# Altium project Smart_Controler.PrjPcb
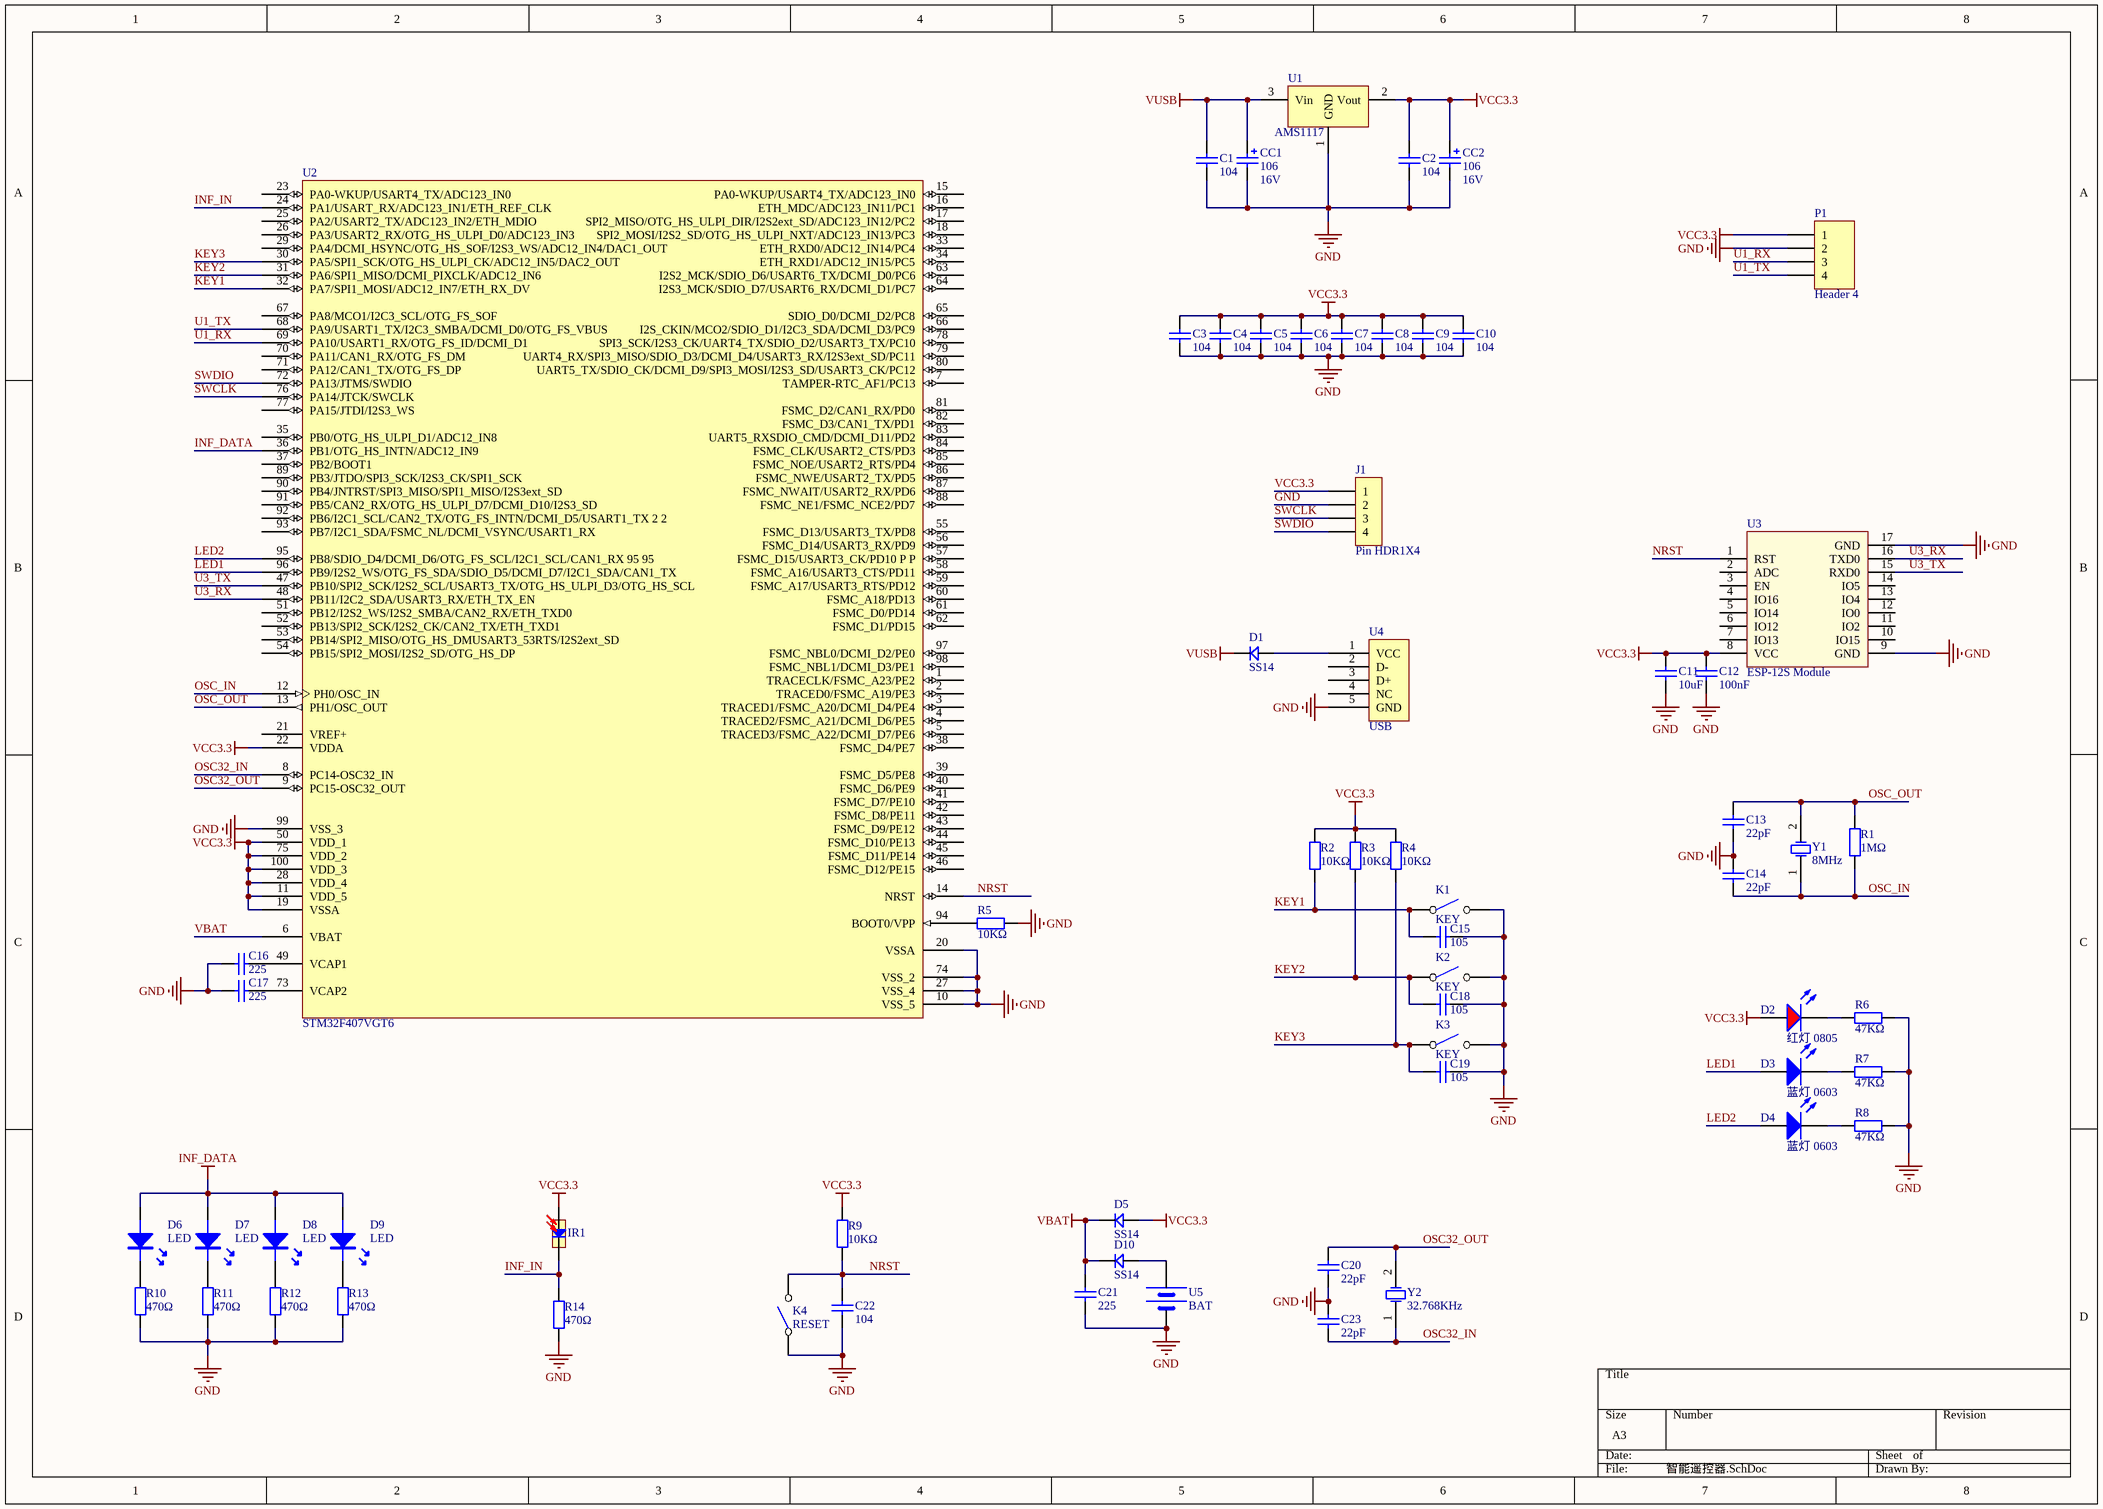
[diagram p0: 智能遥控器.SchDoc]
1 sheet, 63 parts. Net scope: global (net labels, ports and power ports of the same name join across sheets).
Board file: 智能遥控器.PcbDoc

## Sheet 智能遥控器.SchDoc
size A3

### Parts
C1  104  [LC-0805_C]
C2  104  [LC-0805_C]
C3  104  [LC-0805_C]
C4  104  [LC-0805_C]
C5  104  [LC-0805_C]
C6  104  [LC-0805_C]
C7  104  [LC-0805_C]
C8  104  [LC-0805_C]
C9  104  [LC-0805_C]
C10  104  [LC-0805_C]
C11  10uF  [LC-0805_C]
C12  100nF  [LC-0805_C]
C13  22pF  [LC-0805_C]
C14  22pF  [LC-0805_C]
C15  105  [LC-0805_C]
C16  225  [LC-0805_C]
C17  225  [LC-0805_C]
C18  105  [LC-0805_C]
C19  105  [LC-0805_C]
C20  22pF  [LC-0805_C]
C21  225  [LC-0805_C]
C22  104  [LC-0805_C]
C23  22pF  [LC-0805_C]
CC1  Capacitance: 106  Voltage: 16V  [TAN-C-6032]  (hidden comment: Cap Tan C)
CC2  Capacitance: 106  Voltage: 16V  [TAN-C-6032]  (hidden comment: Cap Tan C)
D1  SS14  [LC-SOD-123]
D2  红灯 0805  [LC-0805_LED_S1]
D3  蓝灯 0603  [LC-0805_LED_S1]
D4  蓝灯 0603  [LC-0805_LED_S1]
D5  SS14  [LC-SOD-123]
D6  LED  [LED5-RED]
D7  LED  [LED5-RED]
D8  LED  [LED5-RED]
D9  LED  [LED5-RED]
D10  SS14  [LC-SOD-123]
IR1  IR  [LED-R5-H9-SINGLE-B]  (value not drawn)
J1  Pin HDR1X4  [Pin HDR1X4/2.54mm-S]
K1  KEY  [KEY_2]
K2  KEY  [KEY_2]
K3  KEY  [KEY_2]
K4  RESET  [KEY_2]
P1  Header 4  [HDR1X4]
R1  1MΩ  [LC-0805_R]
R2  10KΩ  [LC-0805_R]
R3  10KΩ  [LC-0805_R]
R4  10KΩ  [LC-0805_R]
R5  10KΩ  [LC-0805_R]
R6  47KΩ  [LC-0805_R]
R7  47KΩ  [LC-0805_R]
R8  47KΩ  [LC-0805_R]
R9  10KΩ  [LC-0805_R]
R10  470Ω  [LC-0805_R]
R11  470Ω  [LC-0805_R]
R12  470Ω  [LC-0805_R]
R13  470Ω  [LC-0805_R]
R14  470Ω  [LC-0805_R]
U1  AMS1117  [SOT-223]
U2  STM32F407VGT6  [LQFP100 14x14]
U3  ESP-12S Module  [ESP-12S Module]
U4  USB  [USB_B]
U5  BAT  [CR1220_A]
Y1  8MHz  [XTAL-SMD]
Y2  32.768KHz  [OSC-3x8-WI-B]

### Nets
GND: C1.1 C2.1 C3.1 C4.1 C5.1 C6.1 C7.1 C8.1 C9.1 C10.1 C11.1 C12.1 C13.1 C14.2 C15.2 C16.1 C17.1 C18.2 C19.2 C20.1 C21.1 C22.1 C23.2 CC1.1 CC2.1 J1.2 K1.2 K2.2 K3.2 K4.1 P1.2 R5.2 R6.2 R7.2 R8.2 R10.1 R11.1 R12.1 R13.1 R14.1 U1.1(GND) U2.10(VSS_5) U2.20(VSSA) U2.27(VSS_4) U2.74(VSS_2) U2.99(VSS_3) U3.9(GND) U3.17(GND) U4.5(GND) U5.2(GND)
INF_DATA: D6.A D7.A D8.A D9.A U2.36(PB1/OTG_HS_INTN/ADC12_IN9)
VBAT: C21.2 D5.2 D10.2 U2.6(VBAT)
VCC3.3: C2.2 C3.2 C4.2 C5.2 C6.2 C7.2 C8.2 C9.2 C10.2 C11.2 C12.2 CC2.2 D2.A D5.1 IR1.1(VCC) J1.1 P1.1 R2.2 R3.2 R4.2 R9.2 U1.2(Vout) U2.11(VDD_5) U2.19(VSSA) U2.22(VDDA) U2.28(VDD_4) U2.50(VDD_1) U2.75(VDD_2) U2.100(VDD_3) U3.8(VCC)
VUSB: C1.2 CC1.2 D1.2 U1.3(Vin)
INF_IN: IR1.2(GND) R14.2 U2.24(PA1/USART_RX/ADC123_IN1/ETH_REF_CLK)
KEY1: C15.1 K1.1 R2.1 U2.32(PA7/SPI1_MOSI/ADC12_IN7/ETH_RX_DV)
KEY2: C18.1 K2.1 R3.1 U2.31(PA6/SPI1_MISO/DCMI_PIXCLK/ADC12_IN6)
KEY3: C19.1 K3.1 R4.1 U2.30(PA5/SPI1_SCK/OTG_HS_ULPI_CK/ADC12_IN5/DAC2_OUT)
LED1: D3.A U2.96(PB9/I2S2_WS/OTG_FS_SDA/SDIO_D5/DCMI_D7/I2C1_SDA/CAN1_TX)
LED2: D4.A U2.95(PB8/SDIO_D4/DCMI_D6/OTG_FS_SCL/I2C1_SCL/CAN1_RX_95_95)
NRST: C22.2 K4.2 R9.1 U2.14(NRST) U3.1(RST)
OSC32_IN: C23.1 U2.8(PC14-OSC32_IN) Y2.1(OSC1)
OSC32_OUT: C20.2 U2.9(PC15-OSC32_OUT) Y2.2(OSC2)
OSC_IN: C14.1 R1.1 U2.12(PH0/OSC_IN) Y1.1(OSC1)
OSC_OUT: C13.2 R1.2 U2.13(PH1/OSC_OUT) Y1.2(OSC2)
SWCLK: J1.3 U2.76(PA14/JTCK/SWCLK)
SWDIO: J1.4 U2.72(PA13/JTMS/SWDIO)
U1_RX: P1.3 U2.69(PA10/USART1_RX/OTG_FS_ID/DCMI_D1)
U1_TX: P1.4 U2.68(PA9/USART1_TX/I2C3_SMBA/DCMI_D0/OTG_FS_VBUS)
U3_RX: U2.48(PB11/I2C2_SDA/USART3_RX/ETH_TX_EN) U3.16(TXD0)
U3_TX: U2.47(PB10/SPI2_SCK/I2S2_SCL/USART3_TX/OTG_HS_ULPI_D3/OTG_HS_SCL) U3.15(RXD0)
NetC16_2: C16.2 U2.49(VCAP1)
NetC17_2: C17.2 U2.73(VCAP2)
NetD1_1: D1.1 U4.1(VCC)
NetD2_K: D2.K R6.1
NetD3_K: D3.K R7.1
NetD4_K: D4.K R8.1
NetD6_K: D6.K R10.2
NetD7_K: D7.K R11.2
NetD8_K: D8.K R12.2
NetD9_K: D9.K R13.2
NetD10_1: D10.1 U5.1(VCC)
NetR5_1: R5.1 U2.94(BOOT0/VPP)

Not connected (* = marked no-connect by the designer): U2 1(TRACECLK/FSMC_A23/PE2) 2(TRACED0/FSMC_A19/PE3) 3(TRACED1/FSMC_A20/DCMI_D4/PE4) 4(TRACED2/FSMC_A21/DCMI_D6/PE5) 5(TRACED3/FSMC_A22/DCMI_D7/PE6) 7(TAMPER-RTC_AF1/PC13) 15(PA0-WKUP/USART4_TX/ADC123_IN0) 16(ETH_MDC/ADC123_IN11/PC1) 17(SPI2_MISO/OTG_HS_ULPI_DIR/I2S2ext_SD/ADC123_IN12/PC2) 18(SPI2_MOSI/I2S2_SD/OTG_HS_ULPI_NXT/ADC123_IN13/PC3) 21(VREF+) 23(PA0-WKUP/USART4_TX/ADC123_IN0) 25(PA2/USART2_TX/ADC123_IN2/ETH_MDIO) 26(PA3/USART2_RX/OTG_HS_ULPI_D0/ADC123_IN3) 29(PA4/DCMI_HSYNC/OTG_HS_SOF/I2S3_WS/ADC12_IN4/DAC1_OUT) 33(ETH_RXD0/ADC12_IN14/PC4) 34(ETH_RXD1/ADC12_IN15/PC5) 35(PB0/OTG_HS_ULPI_D1/ADC12_IN8) 37(PB2/BOOT1) 38(FSMC_D4/PE7) 39(FSMC_D5/PE8) 40(FSMC_D6/PE9) 41(FSMC_D7/PE10) 42(FSMC_D8/PE11) 43(FSMC_D9/PE12) 44(FSMC_D10/PE13) 45(FSMC_D11/PE14) 46(FSMC_D12/PE15) 51(PB12/I2S2_WS/I2S2_SMBA/CAN2_RX/ETH_TXD0) 52(PB13/SPI2_SCK/I2S2_CK/CAN2_TX/ETH_TXD1) 53(PB14/SPI2_MISO/OTG_HS_DMUSART3_53RTS/I2S2ext_SD) 54(PB15/SPI2_MOSI/I2S2_SD/OTG_HS_DP) 55(FSMC_D13/USART3_TX/PD8) 56(FSMC_D14/USART3_RX/PD9) 57(FSMC_D15/USART3_CK/PD10_P_P) 58(FSMC_A16/USART3_CTS/PD11) 59(FSMC_A17/USART3_RTS/PD12) 60(FSMC_A18/PD13) 61(FSMC_D0/PD14) 62(FSMC_D1/PD15) 63(I2S2_MCK/SDIO_D6/USART6_TX/DCMI_D0/PC6) 64(I2S3_MCK/SDIO_D7/USART6_RX/DCMI_D1/PC7) 65(SDIO_D0/DCMI_D2/PC8) 66(I2S_CKIN/MCO2/SDIO_D1/I2C3_SDA/DCMI_D3/PC9) 67(PA8/MCO1/I2C3_SCL/OTG_FS_SOF) 70(PA11/CAN1_RX/OTG_FS_DM) 71(PA12/CAN1_TX/OTG_FS_DP) 77(PA15/JTDI/I2S3_WS) 78(SPI3_SCK/I2S3_CK/UART4_TX/SDIO_D2/USART3_TX/PC10) 79(UART4_RX/SPI3_MISO/SDIO_D3/DCMI_D4/USART3_RX/I2S3ext_SD/PC11) 80(UART5_TX/SDIO_CK/DCMI_D9/SPI3_MOSI/I2S3_SD/USART3_CK/PC12) 81(FSMC_D2/CAN1_RX/PD0) 82(FSMC_D3/CAN1_TX/PD1) 83(UART5_RXSDIO_CMD/DCMI_D11/PD2) 84(FSMC_CLK/USART2_CTS/PD3) 85(FSMC_NOE/USART2_RTS/PD4) 86(FSMC_NWE/USART2_TX/PD5) 87(FSMC_NWAIT/USART2_RX/PD6) 88(FSMC_NE1/FSMC_NCE2/PD7) 89(PB3/JTDO/SPI3_SCK/I2S3_CK/SPI1_SCK) 90(PB4/JNTRST/SPI3_MISO/SPI1_MISO/I2S3ext_SD) 91(PB5/CAN2_RX/OTG_HS_ULPI_D7/DCMI_D10/I2S3_SD) 92(PB6/I2C1_SCL/CAN2_TX/OTG_FS_INTN/DCMI_D5/USART1_TX_2_2) 93(PB7/I2C1_SDA/FSMC_NL/DCMI_VSYNC/USART1_RX) 97(FSMC_NBL0/DCMI_D2/PE0) 98(FSMC_NBL1/DCMI_D3/PE1); U3 2(ADC) 3(EN) 4(IO16) 5(IO14) 6(IO12) 7(IO13) 10(IO15) 11(IO2) 12(IO0) 13(IO4) 14(IO5); U4 2(D-) 3(D+) 4(NC)

### Library data of the parts
C1-C12 C15-C19 C21 = 0805 6.8nF (682) 10% 50V: 贴片电容; ComponentLink1Description: 供应商链接; ComponentLink1URL: http://www.szlcsc.com/product/details_2107.html; Package: 0805; Supplier: LC; SuppliersPartNumber: C1755
C13 C14 C20 C23 = 0805 6pF (6R0) 0.25pF 50V: 贴片电容; ComponentLink1Description: 供应商链接; ComponentLink1URL: http://www.szlcsc.com/product/details_68656.html; Package: 0805; Supplier: LC; SuppliersPartNumber: C67560
C22 = 0805 330nF (334) 10% 50V: 贴片电容; ComponentLink1Description: 供应商链接; ComponentLink1URL: http://www.szlcsc.com/product/details_2092.html; Package: 0805; Supplier: LC; SuppliersPartNumber: C1740
CC1 CC2 = Cap Tan C: Polarized Capacitor (Radial); Published: 8-Jun-2000; Revision: July-2002: Re-released for DXP Platform.; Publisher: Altium Limited
D1 D5 D10 = D
D2 = 0805 红灯: 发光二极管; ComponentLink1Description: 供应商链接; ComponentLink1URL: http://www.szlcsc.com/product/details_2668.html; Package: 0805; Supplier: LC; SuppliersPartNumber: C2295
D3 D4 = 0603 蓝灯: 发光二极管; ComponentLink1Description: 供应商链接; ComponentLink1URL: http://www.szlcsc.com/product/details_73150.html; Package: 0603; Supplier: LC; SuppliersPartNumber: C72041
IR1 = IR: RED Remote Receiver
K1-K4 = KEY: 微动开关
P1 = Header 4: Header, 4-Pin; LatestRevisionDate: 17-Jul-2002; LatestRevisionNote: Re-released for DXP Platform.; Publisher: Altium Limited
R1 R9 = 0805 390KΩ (3903) 1%: 贴片电阻; ComponentLink1Description: 供应商链接; ComponentLink1URL: http://www.szlcsc.com/product/details_18344.html; Package: 0805; Supplier: LC; SuppliersPartNumber: C17656
R2-R4 R6-R8 R10-R14 = 0805 11KΩ (1102) 1%: 贴片电阻; ComponentLink1Description: 供应商链接; ComponentLink1URL: http://www.szlcsc.com/product/details_18117.html; Package: 0805; Supplier: LC; SuppliersPartNumber: C17429
R5 = 0805 1.8KΩ (1801) 1%: 贴片电阻; ComponentLink1Description: 供应商链接; ComponentLink1URL: http://www.szlcsc.com/product/details_18086.html; Package: 0805; Supplier: LC; SuppliersPartNumber: C17398
U1 = AMS1117: 3.3V电压转换器AMS1117
U5 = BAT: 纽扣电池座CR1220
Y1 Y2 = XTAL: 晶体振荡器; Published: 8-Jun-2000; LatestRevisionDate: 17-Jul-2002; LatestRevisionNote: Re-released for DXP Platform.; PackageReference: R38; Publisher: Altium Limited